# Altium schematic sheet PROB_S7CAS_Clock.SchDoc
size Tabloid; SheetNumber: 9; SheetTotal: 15; Sheet_Name: Génération des horloges; Size: 11x17
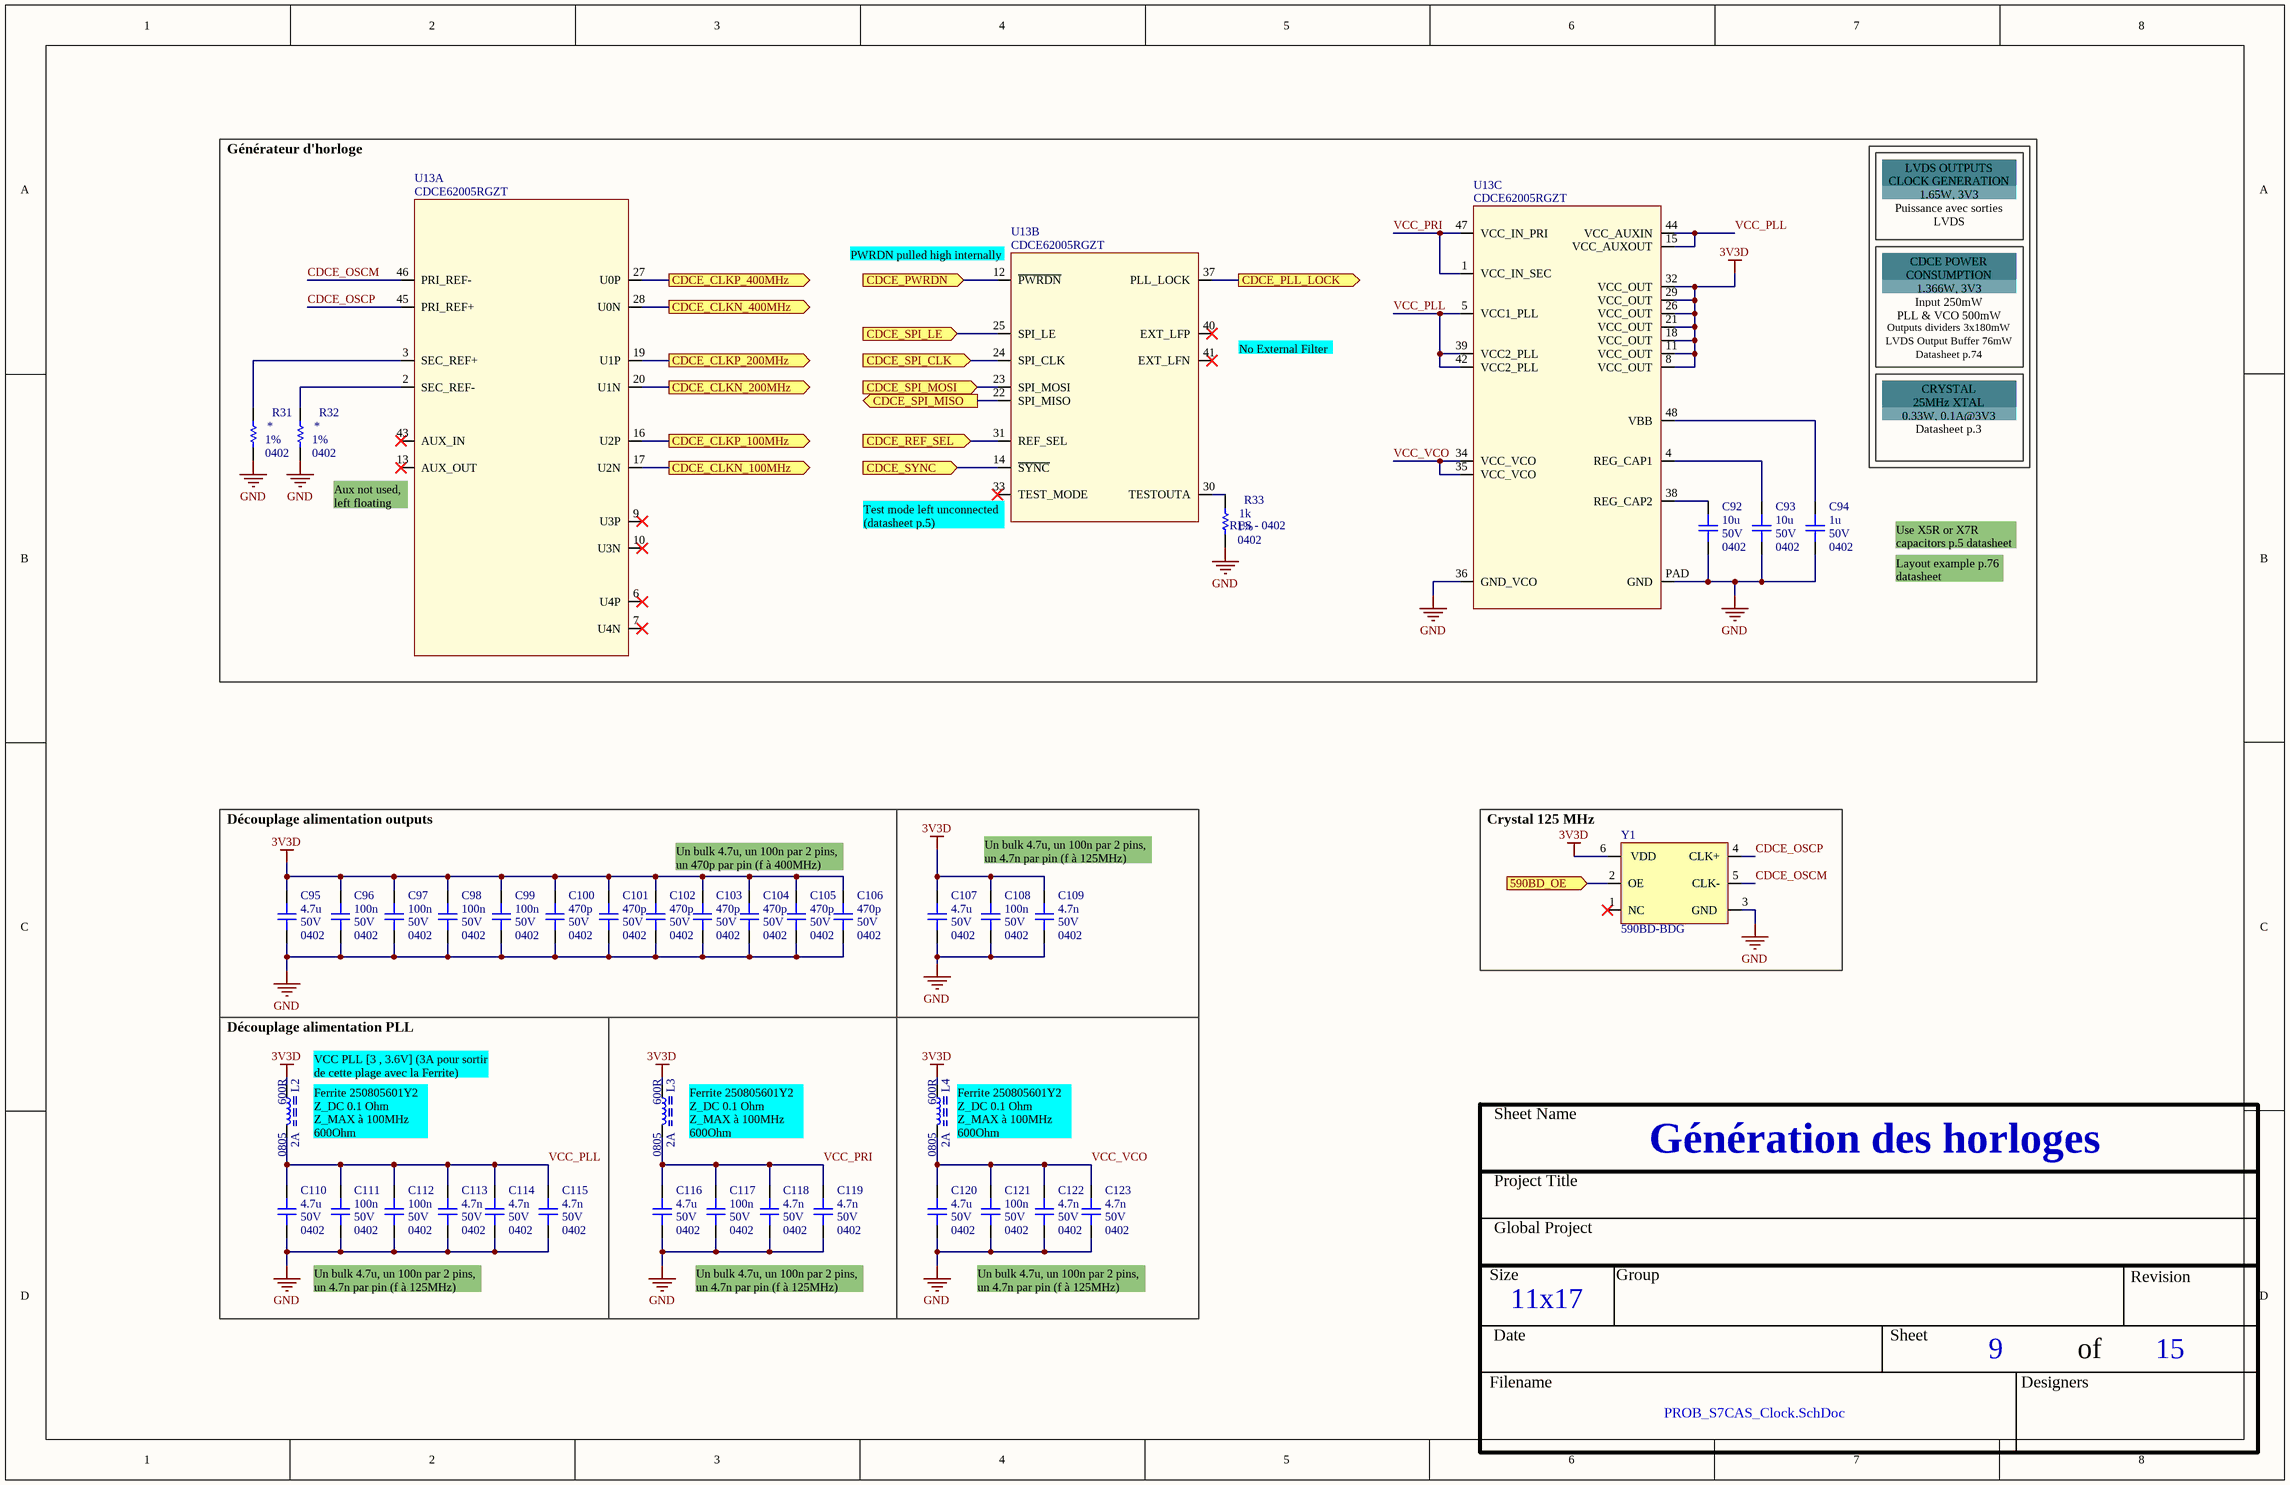
[diagram p0: PROB_S7CAS_Clock.SchDoc]

## Parts
C92  value 10u  Voltage: 50V  Package: 0402  [CAP_0402]  (hidden comment: CAP - 0402)
C93  value 10u  Voltage: 50V  Package: 0402  [CAP_0402]  (hidden comment: CAP - 0402)
C94  value 1u  Voltage: 50V  Package: 0402  [CAP_0402]  (hidden comment: CAP - 0402)
C95  value 4.7u  Voltage: 50V  Package: 0402  [CAP_0402]  (hidden comment: CAP - 0402)
C96  value 100n  Voltage: 50V  Package: 0402  [CAP_0402]  (hidden comment: CAP - 0402)
C97  value 100n  Voltage: 50V  Package: 0402  [CAP_0402]  (hidden comment: CAP - 0402)
C98  value 100n  Voltage: 50V  Package: 0402  [CAP_0402]  (hidden comment: CAP - 0402)
C99  value 100n  Voltage: 50V  Package: 0402  [CAP_0402]  (hidden comment: CAP - 0402)
C100  value 470p  Voltage: 50V  Package: 0402  [CAP_0402]  (hidden comment: CAP - 0402)
C101  value 470p  Voltage: 50V  Package: 0402  [CAP_0402]  (hidden comment: CAP - 0402)
C102  value 470p  Voltage: 50V  Package: 0402  [CAP_0402]  (hidden comment: CAP - 0402)
C103  value 470p  Voltage: 50V  Package: 0402  [CAP_0402]  (hidden comment: CAP - 0402)
C104  value 470p  Voltage: 50V  Package: 0402  [CAP_0402]  (hidden comment: CAP - 0402)
C105  value 470p  Voltage: 50V  Package: 0402  [CAP_0402]  (hidden comment: CAP - 0402)
C106  value 470p  Voltage: 50V  Package: 0402  [CAP_0402]  (hidden comment: CAP - 0402)
C107  value 4.7u  Voltage: 50V  Package: 0402  [CAP_0402]  (hidden comment: CAP - 0402)
C108  value 100n  Voltage: 50V  Package: 0402  [CAP_0402]  (hidden comment: CAP - 0402)
C109  value 4.7n  Voltage: 50V  Package: 0402  [CAP_0402]  (hidden comment: CAP - 0402)
C110  value 4.7u  Voltage: 50V  Package: 0402  [CAP_0402]  (hidden comment: CAP - 0402)
C111  value 100n  Voltage: 50V  Package: 0402  [CAP_0402]  (hidden comment: CAP - 0402)
C112  value 100n  Voltage: 50V  Package: 0402  [CAP_0402]  (hidden comment: CAP - 0402)
C113  value 4.7n  Voltage: 50V  Package: 0402  [CAP_0402]  (hidden comment: CAP - 0402)
C114  value 4.7n  Voltage: 50V  Package: 0402  [CAP_0402]  (hidden comment: CAP - 0402)
C115  value 4.7n  Voltage: 50V  Package: 0402  [CAP_0402]  (hidden comment: CAP - 0402)
C116  value 4.7u  Voltage: 50V  Package: 0402  [CAP_0402]  (hidden comment: CAP - 0402)
C117  value 100n  Voltage: 50V  Package: 0402  [CAP_0402]  (hidden comment: CAP - 0402)
C118  value 4.7n  Voltage: 50V  Package: 0402  [CAP_0402]  (hidden comment: CAP - 0402)
C119  value 4.7n  Voltage: 50V  Package: 0402  [CAP_0402]  (hidden comment: CAP - 0402)
C120  value 4.7u  Voltage: 50V  Package: 0402  [CAP_0402]  (hidden comment: CAP - 0402)
C121  value 100n  Voltage: 50V  Package: 0402  [CAP_0402]  (hidden comment: CAP - 0402)
C122  value 4.7n  Voltage: 50V  Package: 0402  [CAP_0402]  (hidden comment: CAP - 0402)
C123  value 4.7n  Voltage: 50V  Package: 0402  [CAP_0402]  (hidden comment: CAP - 0402)
L2  value 600R  Current: 2A  Package: 0805  [FER_0402]  (hidden comment: FER - 0402)
L3  value 600R  Current: 2A  Package: 0805  [FER_0402]  (hidden comment: FER - 0402)
L4  value 600R  Current: 2A  Package: 0805  [FER_0402]  (hidden comment: FER - 0402)
R31  Package: 0402  Precision: 1%  [RES_0402]  (hidden comment: RES - 0402)
R32  Package: 0402  Precision: 1%  [RES_0402]  (hidden comment: RES - 0402)
R33  RES - 0402  value 1k  Package: 0402  Precision: 1%  [RES_0402]
U13  CDCE62005RGZT  [TIM_CDCE62005RGZT]  (parts A,B,C of 3)
Y1  590BD-BDG  [OSC_590BD-BDG]

## Ports
590BD_OE (in), CDCE_CLKN_100MHz (out), CDCE_CLKN_200MHz (out), CDCE_CLKN_400MHz (out), CDCE_CLKP_100MHz (out), CDCE_CLKP_200MHz (out), CDCE_CLKP_400MHz (out), CDCE_PLL_LOCK (out), CDCE_PWRDN (in), CDCE_REF_SEL (in), CDCE_SPI_CLK (in), CDCE_SPI_LE (in), CDCE_SPI_MISO (out), CDCE_SPI_MOSI (in), CDCE_SYNC (in)

## Nets
3V3D: C95.2 C96.2 C97.2 C98.2 C99.2 C100.2 C101.2 C102.2 C103.2 C104.2 C105.2 C106.2 C107.2 C108.2 C109.2 L2.2 L3.2 L4.2 U13.8(VCC_OUT) U13.11(VCC_OUT) U13.18(VCC_OUT) U13.21(VCC_OUT) U13.26(VCC_OUT) U13.29(VCC_OUT) U13.32(VCC_OUT) Y1.6(VDD)
GND: C92.1 C93.1 C94.1 C95.1 C96.1 C97.1 C98.1 C99.1 C100.1 C101.1 C102.1 C103.1 C104.1 C105.1 C106.1 C107.1 C108.1 C109.1 C110.1 C111.1 C112.1 C113.1 C114.1 C115.1 C116.1 C117.1 C118.1 C119.1 C120.1 C121.1 C122.1 C123.1 R31.1 R32.1 R33.1 U13.36(GND_VCO) U13.PAD(GND) Y1.3(GND)
590BD_OE: Y1.2(OE) ; port 590BD_OE
CDCE_CLKN_100MHz: U13.17(U2N) ; port CDCE_CLKN_100MHz
CDCE_CLKN_200MHz: U13.20(U1N) ; port CDCE_CLKN_200MHz
CDCE_CLKN_400MHz: U13.28(U0N) ; port CDCE_CLKN_400MHz
CDCE_CLKP_100MHz: U13.16(U2P) ; port CDCE_CLKP_100MHz
CDCE_CLKP_200MHz: U13.19(U1P) ; port CDCE_CLKP_200MHz
CDCE_CLKP_400MHz: U13.27(U0P) ; port CDCE_CLKP_400MHz
CDCE_OSCM: U13.46(PRI_REF-) Y1.5(CLK-)
CDCE_OSCP: U13.45(PRI_REF+) Y1.4(CLK+)
CDCE_PLL_LOCK: U13.37(PLL_LOCK) ; port CDCE_PLL_LOCK
CDCE_PWRDN: U13.12(~{PWRDN}) ; port CDCE_PWRDN
CDCE_REF_SEL: U13.31(REF_SEL) ; port CDCE_REF_SEL
CDCE_SPI_CLK: U13.24(SPI_CLK) ; port CDCE_SPI_CLK
CDCE_SPI_LE: U13.25(SPI_LE) ; port CDCE_SPI_LE
CDCE_SPI_MISO: U13.22(SPI_MISO) ; port CDCE_SPI_MISO
CDCE_SPI_MOSI: U13.23(SPI_MOSI) ; port CDCE_SPI_MOSI
CDCE_SYNC: U13.14(~{SYNC}) ; port CDCE_SYNC
VCC_PLL: C110.2 C111.2 C112.2 C113.2 C114.2 C115.2 L2.1 U13.5(VCC1_PLL) U13.15(VCC_AUXOUT) U13.39(VCC2_PLL) U13.42(VCC2_PLL) U13.44(VCC_AUXIN)
VCC_PRI: C116.2 C117.2 C118.2 C119.2 L3.1 U13.1(VCC_IN_SEC) U13.47(VCC_IN_PRI)
VCC_VCO: C120.2 C121.2 C122.2 C123.2 L4.1 U13.34(VCC_VCO) U13.35(VCC_VCO)
NetC92_2: C92.2 U13.38(REG_CAP2)
NetC93_2: C93.2 U13.4(REG_CAP1)
NetC94_2: C94.2 U13.48(VBB)
NetR31_2: R31.2 U13.3(SEC_REF+)
NetR32_2: R32.2 U13.2(SEC_REF-)
NetR33_2: R33.2 U13.30(TESTOUTA)

Not connected (* = marked no-connect by the designer): U13 6(U4P)* 7(U4N)* 9(U3P)* 10(U3N)* 13(AUX_OUT)* 33(TEST_MODE)* 40(EXT_LFP)* 41(EXT_LFN)* 43(AUX_IN)*; Y1 1(NC)*

## Notes on the sheet
- Générateur d'horloge
- LVDS OUTPUTS
- CLOCK GENERATION
- 1.65W, 3V3
- Puissance avec sorties LVDS
- (near U13) PWRDN pulled high internally
- CDCE POWER
- CONSUMPTION
- 1.366W, 3V3
- Input 250mW
- (near U13) No External Filter
- PLL & VCO 500mW
- Outputs dividers 3x180mW
- LVDS Output Buffer 76mW
- Datasheet p.74
- CRYSTAL
- 25MHz XTAL
- 0.33W, 0.1A@3V3
- Datasheet p.3
- (near U13) Aux not used, left floating
- (near U13) Test mode left unconnected (datasheet p.5)
- Use X5R or X7R capacitors p.5 datasheet
- Layout example p.76 datasheet
- Découplage alimentation outputs
- Découplage alimentation oscillateur 125MHz
- (near Y1) Crystal 125 MHz
- Un bulk 4.7u, un 100n par 2 pins, un 470p par pin (f à 400MHz)
- Un bulk 4.7u, un 100n par 2 pins, un 4.7n par pin (f à 125MHz)
- Découplage alimentation PRI et SEC
- Découplage alimentation VCO
- Découplage alimentation PLL
- (near L2) VCC PLL [3 , 3.6V] (3A pour sortir de cette plage avec la Ferrite)
- (near L2) Ferrite 250805601Y2 Z_DC 0.1 Ohm Z_MAX à 100MHz 600Ohm
- (near L3) Ferrite 250805601Y2 Z_DC 0.1 Ohm Z_MAX à 100MHz 600Ohm
- (near L4) Ferrite 250805601Y2 Z_DC 0.1 Ohm Z_MAX à 100MHz 600Ohm
- Sheet Name
- Project Title
- Global Project
- Size
- Group
- Revision
- Date
- Sheet
- of
- Filename
- Designers

## Library data of the parts
C92-C123 = CAP - 0402: Precision: 10%; Current: *; CreatedBy: Jonathan Bouchard; Power: *
R31 R32 = RES - 0402: Voltage: 50V; Power: 1/16W; Current: *; CreatedBy: Jonathan Bouchard; Value: *
R33 = CMP-011-000024-1: Voltage: 50V; Power: 1/16W; Pin Count: 2; Current: *; Source: S7CAS_LIB2021.SchLib; Component Type: Standard; Design Item ID: RES - 0402; CreatedBy: Jonathan Bouchard
U13 = TIM_CDCE62005RGZT: TIM - CLK SYNTH JITTER CLEANER 3:5 - QFN-48; Voltage: 3 V ~ 3.6 V; Mfg: Texas Instruments; Current: *; Power: *; Mfg Part Number: CDCE62005RGZT; HelpURL: http://www.ti.com/lit/ds/symlink/cdce62005.pdf; CreatedBy: Jonathan Bouchard; Temperature: -40°C ~ 85°C; Value: *; Precision: *; Package: QFN-48; Supplier 1: Digikey; Supplier Part Number 1: 296-23947-1-ND
Y1 = OSC_590BD-BDG: TIM - OSC PROG 125MHz ~ 214.999MHz LVDS 3.3V 7PPM EN/DS - 6-SMD; Manufacturer #1: Silicon Labs; Current Rating: 100 mA (supply); Note: Spécifié la fréquence lors de la commande; Voltage rating: 3.3V (supply); Polarized: Yes; Value: ±7ppm (freq Stability), ±20ppm (freq stability total); Magnetic Material: UNKNOWN; GRAMS Lib Spec: 2.8; Manufacturer #2: *; Power Max: *; Part Number #1: 590BD-BDG; Part Number #2: *; HelpURL: https://www.silabs.com/documents/public/data-sheets/Si590-591.pdf; Supplier 1: Digi-Key; Supplier Part Number 1: 590BD-BDG-ND; Assembly Type: SMD; Temperature: -40°C ~ 85°C; Package: 6-SMD; CreatedBy/Date: from 590BD-CDG; Tolerance: *; VerifiedBy: Caroline Paulin / 3/10/2019; Cryo: UNKNOWN
L2-L4 = FER - 0402: Voltage: *; CreatedBy: Jonathan Bouchard; Power: *; Precision: *